# EAGLE design board (EAGLE 6.6.0)
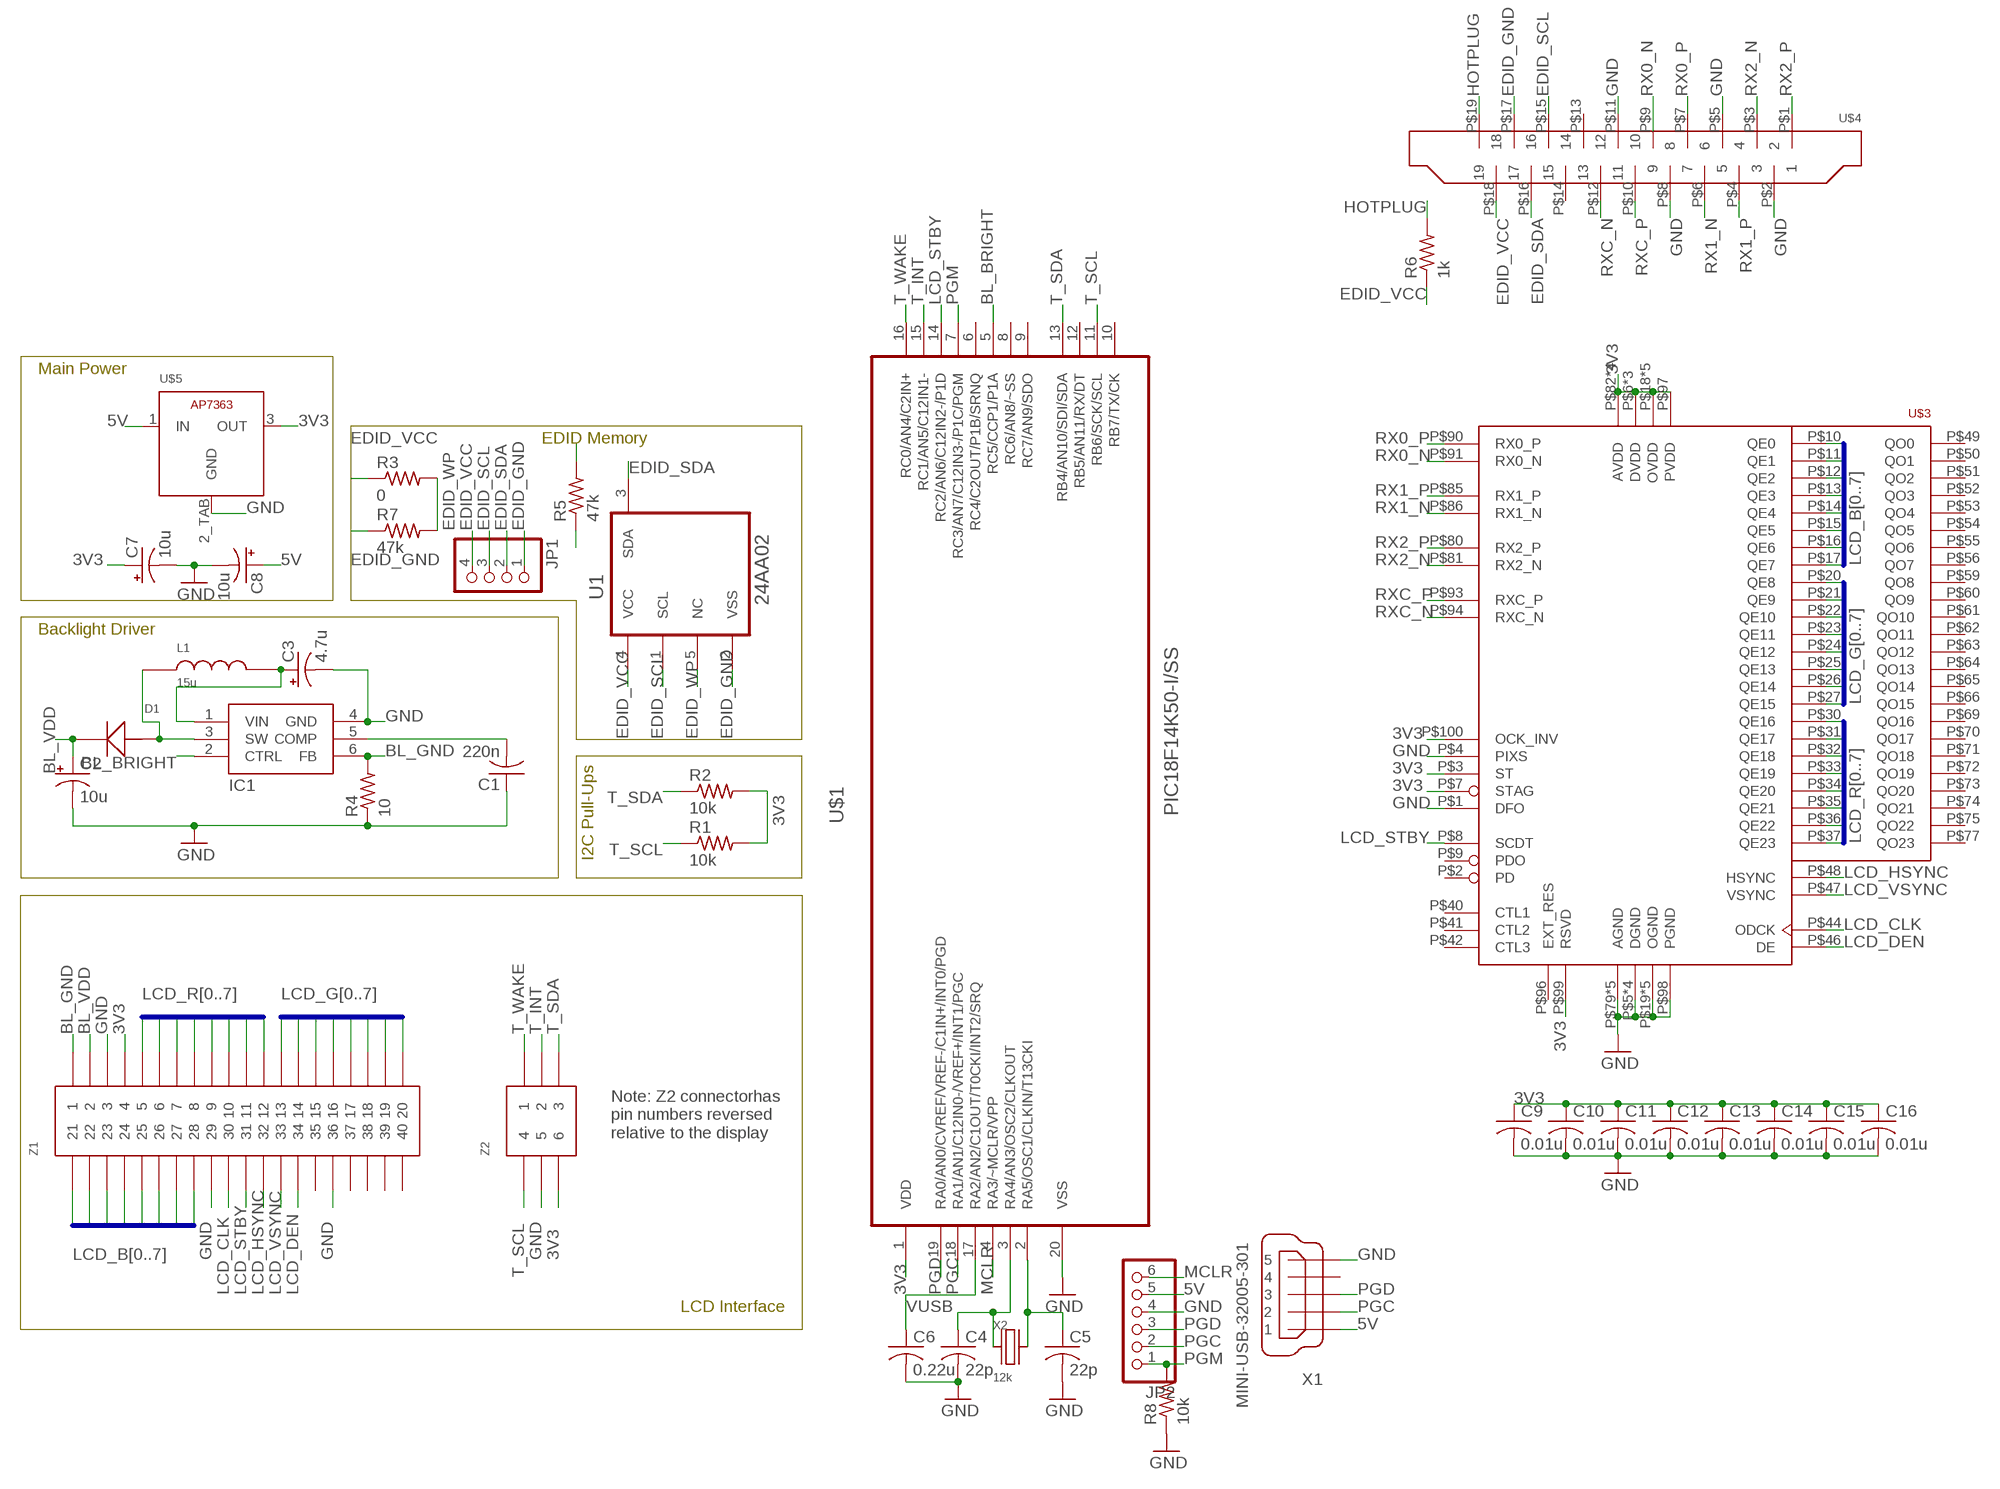
[diagram p0: schematic, sheet 1]

## Parts
C1  220n  C-USC1206  [C1206]
C2  10u  CPOL-USB  [PANASONIC_B]
C3  4.7u  CPOL-USB  [PANASONIC_B]
C4  22p  C-USC1206K  [C1206K]
C5  22p  C-USC1206K  [C1206K]
C6  0.22u  C-USC1206K  [C1206K]
C7  10u  CPOL-USB  [PANASONIC_B]
C8  10u  CPOL-USB  [PANASONIC_B]
C9  0.01u  C-USC0805  [C0805]
C10  0.01u  C-USC0805  [C0805]
C11  0.01u  C-USC0805  [C0805]
C12  0.01u  C-USC0805  [C0805]
C13  0.01u  C-USC0805  [C0805]
C14  0.01u  C-USC0805  [C0805]
C15  0.01u  C-USC0805  [C0805]
C16  0.01u  C-USC0805  [C0805]
D1  MBR0540  [SOD123]
IC1  TPS61165  [SOT-23-6]
JP1  PINHD-1X4/90  [1X04/90]
JP2  PINHD-1X6  [1X06]
L1  15u  0520CDMCDS  [0520CDMCDS]
R1  10k  R-US_R1206  [R1206]
R2  10k  R-US_R1206  [R1206]
R3  0  R-US_R0805  [R0805]
R4  10  R-US_R0805  [R0805]
R5  47k  R-US_R1206  [R1206]
R6  1k  R-US_R1206  [R1206]
R7  47k  R-US_R1206  [R1206]
R8  10k  R-US_R1206  [R1206]
U1  24AA02  24AA02E64T-I/OT  [SOT95P270X145-5N]
U$1  PIC18F14K50-I/SS  [SOP65P780X200-20N]
U$3  TFP401  [PQFP-100]
U$4  HDMI-RCPT  [HDMI-RA-SMD]
U$5  AP7363TO252  [TO252]
X1  MINI-USB-32005-301  [32005-301]
X2  12k  CTS-445  [CTS-445]
Z1  62684-401100ALF  [62684-401100ALF]
Z2  84952-6  [84952-6]

## Nets
3V3: C7.+ C9.1 C10.1 C11.1 C12.1 C13.1 C14.1 C15.1 C16.1 R1.2 R2.2 U$1.1(VDD) U$3.P$3(ST) U$3.P$6(DVDD) U$3.P$7(STAG) U$3.P$18(OVDD) U$3.P$29(OVDD) U$3.P$38(DVDD) U$3.P$43(OVDD) U$3.P$57(OVDD) U$3.P$67(DVDD) U$3.P$78(OVDD) U$3.P$82(AVDD) U$3.P$84(AVDD) U$3.P$88(AVDD) U$3.P$95(AVDD) U$3.P$97(PVDD) U$3.P$99(RSVD) U$3.P$100(OCK_INV) U$5.3(OUT) Z1.4 Z2.6
5V: C3.+ C8.+ IC1.1(VIN) JP2.5 L1.P$2 U$5.1(IN) X1.1
BL_BRIGHT: IC1.2(CTRL) U$1.5(RC5/CCP1/P1A)
BL_COMP: C1.2 IC1.5(COMP)
BL_GND: IC1.6(FB) R4.2 Z1.1
BL_SW: D1.A IC1.3(SW) L1.P$1
BL_VDD: C2.+ D1.K Z1.2
EDID_GND: JP1.1 R7.1 U1.2(VSS) U$4.P$17
EDID_SCL: JP1.3 R5.2 U1.1(SCL) U$4.P$15
EDID_SDA: JP1.2 U1.3(SDA) U$4.P$16
EDID_VCC: JP1.4 R3.1 R5.1 R6.1 U1.4(VCC) U$4.P$18
EDID_WP: R3.2 R7.2 U1.5(NC)
GND: C1.1 C2.- C3.- C4.2 C5.2 C6.2 C7.- C8.- C9.2 C10.2 C11.2 C12.2 C13.2 C14.2 C15.2 C16.2 IC1.4(GND) JP2.4 R4.1 R8.1 U$1.20(VSS) U$3.P$1(DFO) U$3.P$4(PIXS) U$3.P$5(DGND) U$3.P$19(OGND) U$3.P$28(OGND) U$3.P$39(DGND) U$3.P$45(OGND) U$3.P$58(OGND) U$3.P$68(DGND) U$3.P$76(OGND) U$3.P$79(AGND) U$3.P$83(AGND) U$3.P$87(AGND) U$3.P$89(AGND) U$3.P$92(AGND) U$3.P$98(PGND) U$3.PAD(DGND) U$4.P$2 U$4.P$5 U$4.P$8 U$4.P$11 U$5.2_TAB(GND) X1.5 Z1.3 Z1.29 Z1.36 Z2.5
HOTPLUG: R6.2 U$4.P$19
LCD_B0: U$3.P$10(QE0) Z1.21
LCD_B1: U$3.P$11(QE1) Z1.22
LCD_B2: U$3.P$12(QE2) Z1.23
LCD_B3: U$3.P$13(QE3) Z1.24
LCD_B4: U$3.P$14(QE4) Z1.25
LCD_B5: U$3.P$15(QE5) Z1.26
LCD_B6: U$3.P$16(QE6) Z1.27
LCD_B7: U$3.P$17(QE7) Z1.28
LCD_CLK: U$3.P$44(ODCK) Z1.30
LCD_DEN: U$3.P$46(DE) Z1.34
LCD_G0: U$3.P$20(QE8) Z1.13
LCD_G1: U$3.P$21(QE9) Z1.14
LCD_G2: U$3.P$22(QE10) Z1.15
LCD_G3: U$3.P$23(QE11) Z1.16
LCD_G4: U$3.P$24(QE12) Z1.17
LCD_G5: U$3.P$25(QE13) Z1.18
LCD_G6: U$3.P$26(QE14) Z1.19
LCD_G7: U$3.P$27(QE15) Z1.20
LCD_HSYNC: U$3.P$48(HSYNC) Z1.32
LCD_R0: U$3.P$30(QE16) Z1.5
LCD_R1: U$3.P$31(QE17) Z1.6
LCD_R2: U$3.P$32(QE18) Z1.7
LCD_R3: U$3.P$33(QE19) Z1.8
LCD_R4: U$3.P$34(QE20) Z1.9
LCD_R5: U$3.P$35(QE21) Z1.10
LCD_R6: U$3.P$36(QE22) Z1.11
LCD_R7: U$3.P$37(QE23) Z1.12
LCD_STBY: U$1.14(RC2/AN6/C12IN2-/P1D) U$3.P$8(SCDT) Z1.31
LCD_VSYNC: U$3.P$47(VSYNC) Z1.33
MCLR: JP2.6 U$1.4(RA3/~MCLR/VPP)
N$1: C4.1 U$1.3(RA4/AN3/OSC2/CLKOUT) X2.X1
N$2: C5.1 U$1.2(RA5/OSC1/CLKIN/T13CKI) X2.X2
PGC: JP2.2 U$1.18(RA1/AN1/C12IN0-/VREF+/INT1/PGC) X1.2
PGD: JP2.3 U$1.19(RA0/AN0/CVREF/VREF-/C1IN+/INT0/PGD) X1.3
PGM: JP2.1 R8.2 U$1.7(RC3/AN7/C12IN3-/P1C/PGM)
RX0_N: U$3.P$91(RX0_N) U$4.P$9
RX0_P: U$3.P$90(RX0_P) U$4.P$7
RX1_N: U$3.P$86(RX1_N) U$4.P$6
RX1_P: U$3.P$85(RX1_P) U$4.P$4
RX2_N: U$3.P$81(RX2_N) U$4.P$3
RX2_P: U$3.P$80(RX2_P) U$4.P$1
RXC_N: U$3.P$94(RXC_N) U$4.P$12
RXC_P: U$3.P$93(RXC_P) U$4.P$10
T_INT: U$1.15(RC1/AN5/C12IN1-) Z2.2
T_SCL: R1.1 U$1.11(RB6/SCK/SCL) Z2.4
T_SDA: R2.1 U$1.13(RB4/AN10/SDI/SDA) Z2.3
T_WAKE: U$1.16(RC0/AN4/C2IN+) Z2.1
VUSB: C6.1 U$1.17(RA2/AN2/C1OUT/T0CKI/INT2/SRQ)
Unconnected: U$1.6(RC4/C2OUT/P1B/SRNQ) U$1.8(RC6/AN8/~SS) U$1.9(RC7/AN9/SDO) U$1.10(RB7/TX/CK) U$1.12(RB5/AN11/RX/DT) U$3.P$2(PD) U$3.P$9(PDO) U$3.P$40(CTL1) U$3.P$41(CTL2) U$3.P$42(CTL3) U$3.P$49(QO0) U$3.P$50(QO1) U$3.P$51(QO2) U$3.P$52(QO3) U$3.P$53(QO4) U$3.P$54(QO5) U$3.P$55(QO6) U$3.P$56(QO7) U$3.P$59(QO8) U$3.P$60(QO9) U$3.P$61(QO10) U$3.P$62(QO11) U$3.P$63(QO12) U$3.P$64(QO13) U$3.P$65(QO14) U$3.P$66(QO15) U$3.P$69(QO16) U$3.P$70(QO17) U$3.P$71(QO18) U$3.P$72(QO19) U$3.P$73(QO20) U$3.P$74(QO21) U$3.P$75(QO22) U$3.P$77(QO23) U$3.P$96(EXT_RES) U$4.P$13 U$4.P$14 X1.4 Z1.35 Z1.37 Z1.38 Z1.39 Z1.40

## Buses
LCD_R[0..7]
LCD_G[0..7]
LCD_B[0..7]

## Notes on the sheet
- Main Power
- EDID Memory
- Backlight Driver
- I2C Pull-Ups
- Note: Z2 connectorhas
  pin numbers reversed
  relative to the display
- LCD Interface

## Library data of the parts
C1 C4-C6 C9-C16 = resistor:C-US: CAPACITOR, American symbol
C2 C3 C7 C8 = resistor:CPOL-US: POLARIZED CAPACITOR, American symbol
D1 = ic:MBR0540
IC1 = ic:TPS61165: TPS61165 High Brightness White LED Driver
JP1 = pinhead:PINHD-1X4: PIN HEADER
JP2 = pinhead:PINHD-1X6: PIN HEADER
L1 = ic:0520CDMCDS
R1-R8 = resistor:R-US_: RESISTOR, American symbol
U1 = Microchip-24AA02E64T-I_OT:24AA02E64T-I/OT: 2K I2C™ Serial EEPROMs, SOT23-5; MPN: 24AA02E64T-I/OT; OC_FARNELL: 2345567; OC_NEWARK: 01X0461; PACKAGE: SOT23-5; SUPPLIER: Microchip
U$1 = Microchip_By_element14_Batch_1:PIC18F14K50-I/SS: Flash Microcontrollers; MPN: PIC18F14K50-I/SS; OC_FARNELL: 1648504; OC_NEWARK: 77M3105; PACKAGE: SOP-20; SUPPLIER: Microchip
U$3 = tfp401:TFP401: TFP401 TI PANELBUS DIGITAL RECEIVER
U$4 = conn-hdmi:HDMI-RCPT
U$5 = ap7363:AP7363
X1 = con-cypressindustries:MINI-USB-: MINI USB-B Conector Source: www.cypressindustries.com; OC_FARNELL: unknown; OC_NEWARK: unknown
X2 = ic:CTS-445
Z1 = conn:62684-401100ALF
Z2 = conn:84952-6

## Board
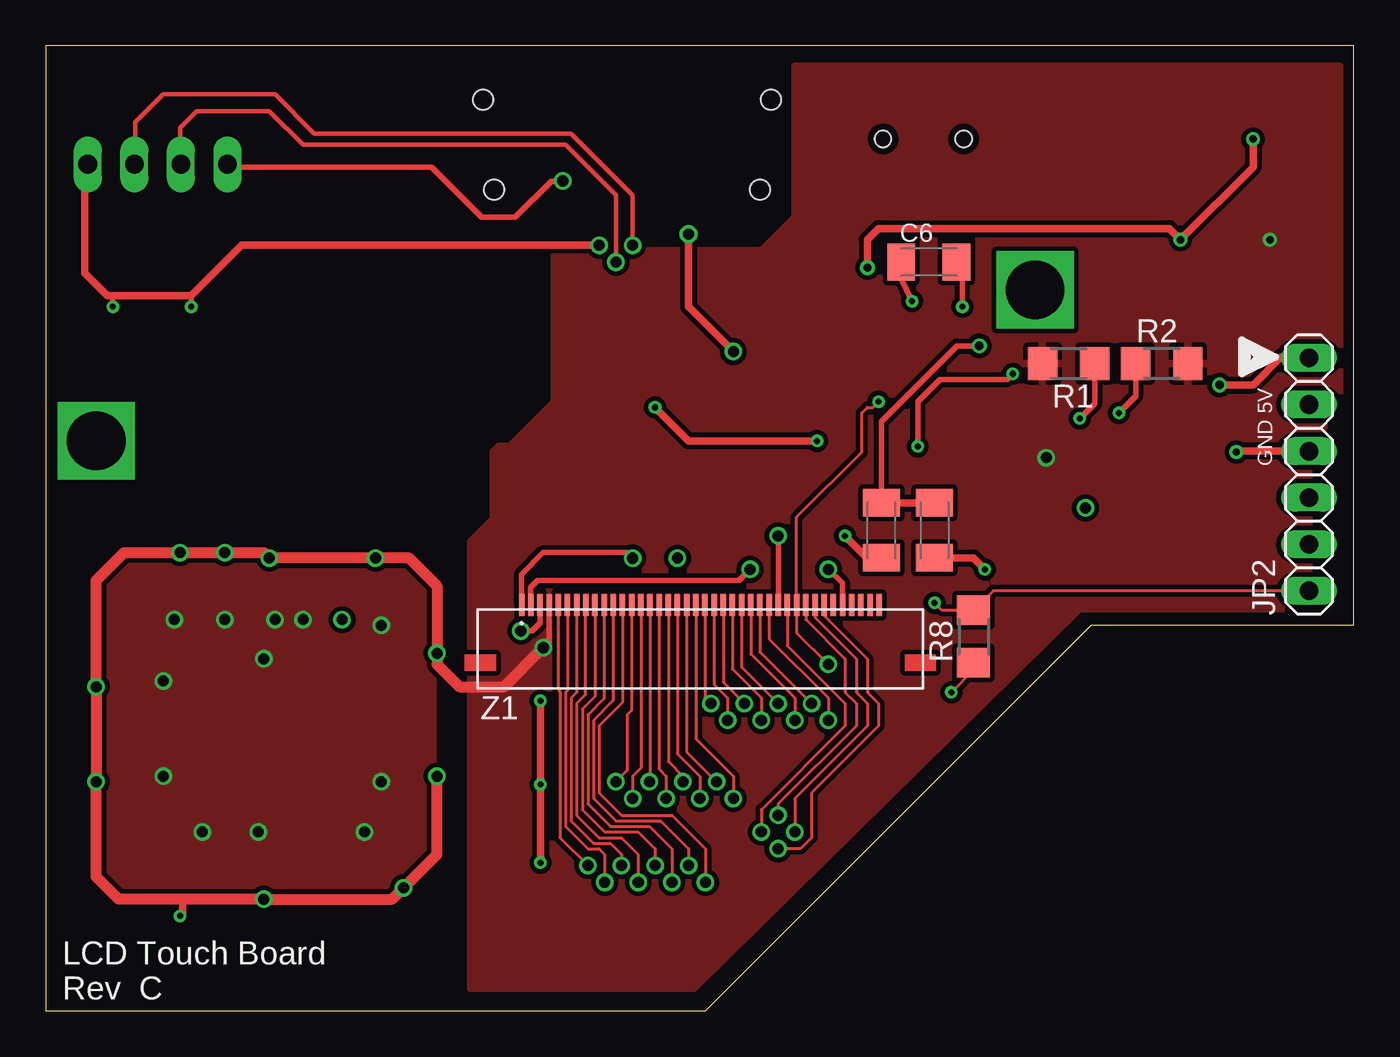
[diagram p1: board, top side]
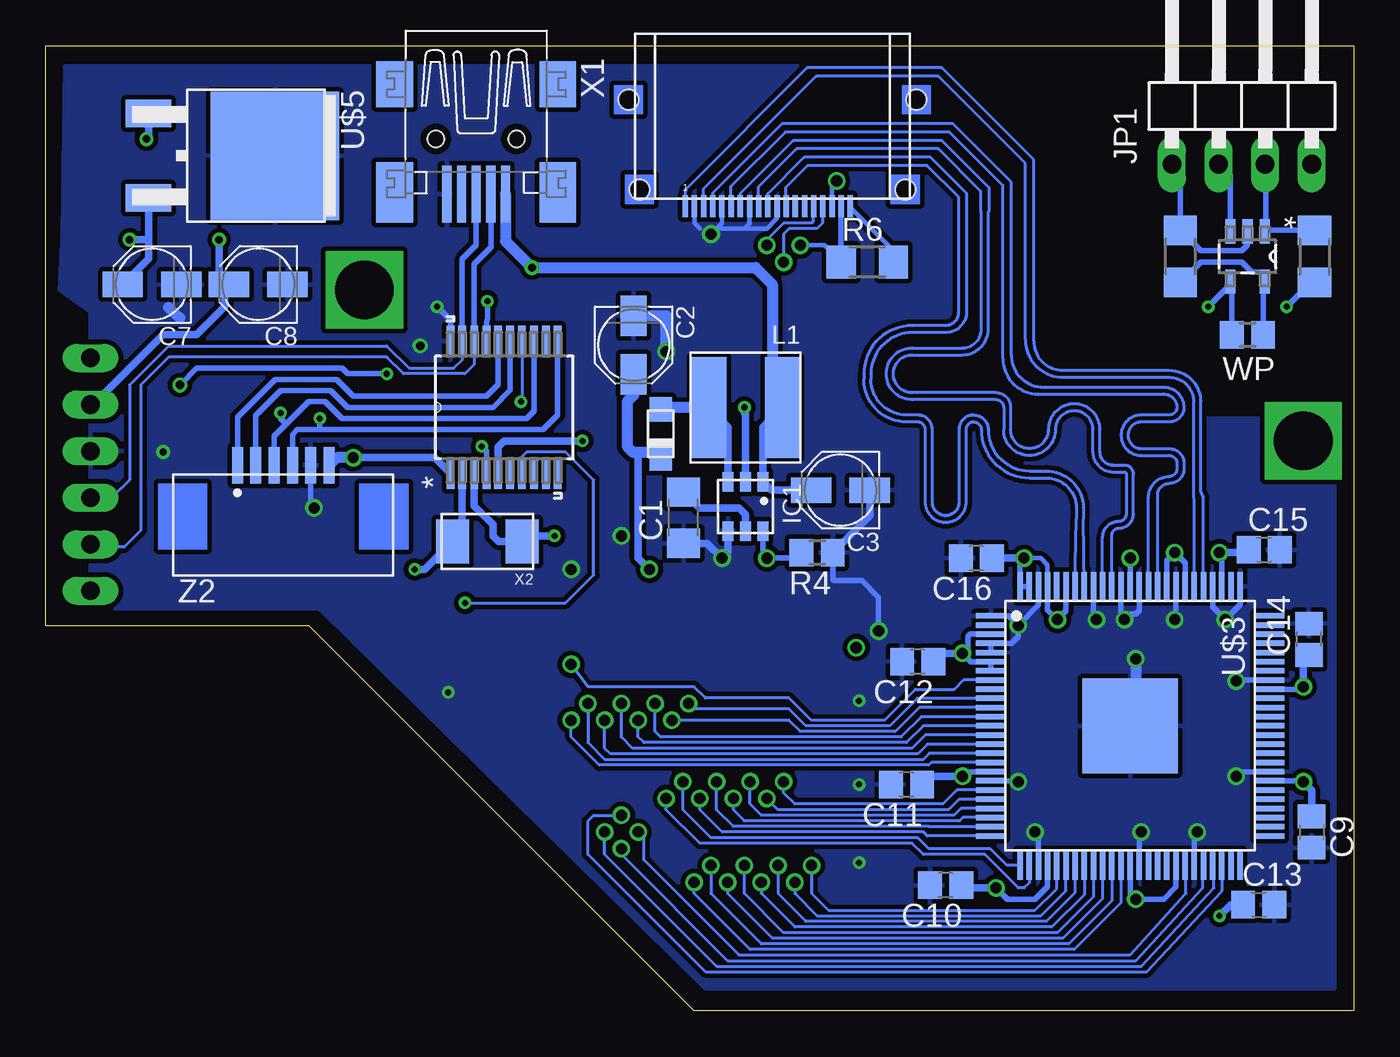
[diagram p2: board, bottom side, seen from below]

Size 71.32 x 52.64 mm. Coordinates in mm from the lower left corner, seen from the top.
Outline: 0,0 35.97,0 57,21.03 71.32,21.03 71.32,52.64 0,52.64 0,0
Copper layers (1*16): Top 0.0356mm / dielectric 1.5011mm / Bottom 0.0356mm
Design rules "LaenPCBOrder": minimum track width 6mil, minimum drill 13mil, track to track 6mil, track to pad 6mil, pad to pad 6mil, via to via 6mil, smd to smd 6mil, copper to edge 15mil, drill to drill 6mil, minimum pad ring 7mil, minimum via ring 7mil, stop-mask expansion 3mil, vias tented up to drill 0mil, thermal gap 10mil

### Footprints (pad centres in the part's own frame; a part is rotated, then mirrored left to right if it is on the bottom)
C1206 = smd 1.6 x 1.8: 1 -1.4,0; 2 1.4,0
PANASONIC_B = smd 2.2 x 1.4: + 1.6,0; - -1.6,0
C1206K = smd 1.5 x 2: 1 -1.5,0; 2 1.5,0
C0805 = smd 1.3 x 1.5: 1 -0.85,0; 2 0.85,0
SOD123 = smd 1.321 x 1.219: A -1.333,0; K 1.333,0
SOT-23-6 = smd 0.6 x 1.05: 1 -0.95,-1.35; 2 0,-1.35; 3 0.95,-1.35; 4 0.95,1.35; 5 0,1.35; 6 -0.95,1.35
1X04/90 = drill 1.016 long: 1 -3.81,-3.81; 2 -1.27,-3.81; 3 1.27,-3.81; 4 3.81,-3.81
1X06 = drill 1.016 long: 1 -6.35,0; 2 -3.81,0; 3 -1.27,0; 4 1.27,0; 5 3.81,0; 6 6.35,0
0520CDMCDS = smd 1.9 x 5.5: P$1 2,0; P$2 -2,0
R1206 = smd 1.6 x 1.803: 1 -1.422,0; 2 1.422,0
R0805 = smd 1.3 x 1.5: 1 -0.85,0; 2 0.85,0
SOT95P270X145-5N = smd 1.321 x 0.559: 1 -1.372,0.94; 2 -1.372,0; 3 -1.372,-0.94; 4 1.372,-0.94; 5 1.372,0.94
SOP65P780X200-20N = smd 1.676 x 0.432: 1 -3.607,2.921; 2 -3.607,2.286; 3 -3.607,1.626; 4 -3.607,0.965; 5 -3.607,0.33; 6 -3.607,-0.33; 7 -3.607,-0.965; 8 -3.607,-1.626; 9 -3.607,-2.286; 10 -3.607,-2.921; 11 3.607,-2.921; 12 3.607,-2.286; 13 3.607,-1.626; 14 3.607,-0.965; 15 3.607,-0.33; 16 3.607,0.33; 17 3.607,0.965; 18 3.607,1.626; 19 3.607,2.286; 20 3.607,2.921
PQFP-100 = smd 0.3 x 1.6: P$1 -6,-7.6; P$2 -5.5,-7.6; P$3 -5,-7.6; P$4 -4.5,-7.6; P$5 -4,-7.6; P$6 -3.5,-7.6; P$7 -3,-7.6; P$8 -2.5,-7.6; P$9 -2,-7.6; P$10 -1.5,-7.6; P$11 -1,-7.6; P$12 -0.5,-7.6; P$13 0,-7.6; P$14 0.5,-7.6; P$15 1,-7.6; P$16 1.5,-7.6; P$17 2,-7.6; P$18 2.5,-7.6; P$19 3,-7.6; P$20 3.5,-7.6; P$21 4,-7.6; P$22 4.5,-7.6; P$23 5,-7.6; P$24 5.5,-7.6; P$25 6,-7.6; P$51 6,7.6; P$52 5.5,7.6; P$53 5,7.6; P$54 4.5,7.6; P$55 4,7.6; P$56 3.5,7.6; P$57 3,7.6; P$58 2.5,7.6; P$59 2,7.6; P$60 1.5,7.6; P$61 1,7.6; P$62 0.5,7.6; P$63 0,7.6; P$64 -0.5,7.6; P$65 -1,7.6; P$66 -1.5,7.6; P$67 -2,7.6; P$68 -2.5,7.6; P$69 -3,7.6; P$70 -3.5,7.6; P$71 -4,7.6; P$72 -4.5,7.6; P$73 -5,7.6; P$74 -5.5,7.6; P$75 -6,7.6 | smd 1.6 x 0.3: P$26 7.6,-6; P$27 7.6,-5.5; P$28 7.6,-5; P$29 7.6,-4.5; P$30 7.6,-4; P$31 7.6,-3.5; P$32 7.6,-3; P$33 7.6,-2.5; P$34 7.6,-2; P$35 7.6,-1.5; P$36 7.6,-1; P$37 7.6,-0.5; P$38 7.6,0; P$39 7.6,0.5; P$40 7.6,1; P$41 7.6,1.5; P$42 7.6,2; P$43 7.6,2.5; P$44 7.6,3; P$45 7.6,3.5; P$46 7.6,4; P$47 7.6,4.5; P$48 7.6,5; P$49 7.6,5.5; P$50 7.6,6; P$76 -7.6,6; P$77 -7.6,5.5; P$78 -7.6,5; P$79 -7.6,4.5; P$80 -7.6,4; P$81 -7.6,3.5; P$82 -7.6,3; P$83 -7.6,2.5; P$84 -7.6,2; P$85 -7.6,1.5; P$86 -7.6,1; P$87 -7.6,0.5; P$88 -7.6,0; P$89 -7.6,-0.5; P$90 -7.6,-1; P$91 -7.6,-1.5; P$92 -7.6,-2; P$93 -7.6,-2.5; P$94 -7.6,-3; P$95 -7.6,-3.5; P$96 -7.6,-4; P$97 -7.6,-4.5; P$98 -7.6,-5; P$99 -7.6,-5.5; P$100 -7.6,-6 | smd 5.2 x 5.2: PAD 0,0
HDMI-RA-SMD = smd 0.3 x 1.2: P$1 4.75,0.6; P$2 4.25,0.6; P$3 3.75,0.6; P$4 3.25,0.6; P$5 2.75,0.6; P$6 2.25,0.6; P$7 1.75,0.6; P$8 1.25,0.6; P$9 0.75,0.6; P$10 0.25,0.6; P$11 -0.25,0.6; P$12 -0.75,0.6; P$13 -1.25,0.6; P$14 -1.75,0.6; P$15 -2.25,0.6; P$16 -2.75,0.6; P$17 -3.25,0.6; P$18 -3.75,0.6; P$19 -4.25,0.6 | hole 1.1: -7.25,-0.3; 7.25,-0.3; -7.85,-5.2; 7.85,-5.2
TO252 = smd 1.5 x 2.5: 1 -2.3,-6.9; 3 2.3,-6.9 | smd 7 x 7: 2_TAB 0,0
32005-301 = smd 3.1 x 0.5: 1 3,1.6; 2 3,0.8; 3 3,0; 4 3,-0.8; 5 3,-1.6 | smd 2.5 x 2: M1 -3,-4.45; M2 -3,4.45 | smd 3.3 x 2: M3 2.9,4.45; M4 2.9,-4.45 | hole 0.9: 0,2.2; 0,-2.2
CTS-445 = smd 1.8 x 2.4: X1 -1.9,0; X2 1.9,0
62684-401100ALF = smd 0.3 x 1.2: 1 -9.75,2; 2 -9.25,2; 3 -8.75,2; 4 -8.25,2; 5 -7.75,2; 6 -7.25,2; 7 -6.75,2; 8 -6.25,2; 9 -5.75,2; 10 -5.25,2; 11 -4.75,2; 12 -4.25,2; 13 -3.75,2; 14 -3.25,2; 15 -2.75,2; 16 -2.25,2; 17 -1.75,2; 18 -1.25,2; 19 -0.75,2; 20 -0.25,2; 21 0.25,2; 22 0.75,2; 23 1.25,2; 24 1.75,2; 25 2.25,2; 26 2.75,2; 27 3.25,2; 28 3.75,2; 29 4.25,2; 30 4.75,2; 31 5.25,2; 32 5.75,2; 33 6.25,2; 34 6.75,2; 35 7.25,2; 36 7.75,2; 37 8.25,2; 38 8.75,2; 39 9.25,2; 40 9.75,2
84952-6 = smd 0.6 x 2: 1 -2.5,1; 2 -1.5,1; 3 -0.5,1; 4 0.5,1; 5 1.5,1; 6 2.5,1

### Placement (x,y rotation side)
C1  36.55,26.9 90 bottom
C2  39.27,36.31 270 bottom
C3  27.99,28.4 180 bottom
C4  45.57,26.21 90 top
C5  48.46,26.21 90 top
C6  48.16,40.84 0 top
C7  65.53,39.62 180 bottom
C8  59.74,39.62 180 bottom
C9  2.29,9.75 270 bottom
C10  22.25,6.86 180 bottom
C11  24.38,12.34 180 bottom
C12  23.77,19.05 180 bottom
C13  5.18,5.79 0 bottom
C14  2.44,20.27 90 bottom
C15  4.88,25.15 0 bottom
C16  20.57,24.69 180 bottom
D1  37.78,31.47 270 bottom
IC1  33.16,27.51 180 bottom
JP1  6.1,49.99 0 bottom
JP2  68.88,29.26 90 top
L1  33.16,32.9 180 bottom
R1  55.78,35.31 180 top
R2  60.86,35.31 0 top
R3  5.79,36.88 0 bottom
R4  29.26,24.99 180 bottom
R5  2.13,41.15 90 bottom
R6  26.52,40.84 0 bottom
R7  9.45,41.15 270 bottom
R8  50.6,20.42 90 top
U1  5.79,41.15 270 bottom
U$1  46.33,32.92 90 bottom
U$3  12.19,15.54 270 bottom
U$4  31.7,44.5 180 bottom
U$5  58.83,46.63 270 bottom
X1  47.85,47.55 270 bottom
X2  47.24,25.6 180 bottom
Z1  35.7,20.14 0 top
Z2  58.38,28.76 0 bottom

### Tracks (layer width: path | path; a pad name or v marks a point on that pad's centre or on a via)
3V3  (via drill 0.33 pad 0.33, 0.41, 0.6, 0.61)
  Top 0.305: Z1.4 27.45,20.13 v27.13,19.81
  Top 0.406: v7.32,5.18 7.47,5.33 7.47,6.1
  Top 0.61: v27.13,19.81 24.99,17.68 22.56,17.68 21.34,18.9 v21.34,19.51 21.34,23.16 19.81,24.69 v17.98,24.69 v12.19,24.69 11.89,24.99 v9.75,24.99 v7.32,24.99 4.27,24.99 2.74,23.47 v2.74,17.68 v2.74,12.5 2.74,7.32 3.96,6.1 7.47,6.1 v11.89,6.1 18.9,6.1 v19.51,6.71 21.34,8.53 v21.34,12.8
  Bottom 0.254: U$3.P$97 16.69,24.31 17.07,24.69 v17.98,24.69
  Bottom 0.305: U$3.P$29 16.69,6.78 17.37,6.1 18.9,6.1 v19.51,6.71 | U$3.P$43 9.69,6.77 10.36,6.1 v11.89,6.1 12.19,6.4 U$3.P$38 | U$3.P$57 2.79,12.55 v2.74,12.5 | U$3.P$67 2.88,17.55 v2.74,17.68 | U$3.P$84 10.19,24.55 v9.75,24.99 9.19,24.43 U$3.P$82 | U$3.P$78 7.19,24.87 v7.32,24.99 | U$3.P$7 U$3.P$6 20.88,19.05 v21.34,19.51 21.03,19.51 21.03,20.42 20.91,20.55 U$3.P$3 | U$3.P$99 U$3.P$100 18.19,24.48 v17.98,24.69 | U$3.P$97 16.69,21.87 v16.15,21.34 15.69,21.8 U$3.P$95 | U$3.P$88 v12.19,24.69 | v21.34,12.8 21.09,13.05 U$3.P$18
  Bottom 0.406: v2.74,12.5 2.29,12.04 C9.1 | C10.1 21.25,6.71 v19.51,6.71 | C11.1 23.08,12.8 v21.34,12.8 | C12.1 22.47,19.51 v21.34,19.51 | v7.32,5.18 6.71,5.79 C13.1 | C14.1 2.74,19.11 v2.74,17.68 | C15.1 5.88,24.99 v7.32,24.99 | C16.1 v17.98,24.69 | v54.56,30.17 50.11,30.17 U$1.1 | U$5.3 65.73,42.06 | 65.73,42.06 65.73,41.03 C7.+ | v66.75,42.06 65.73,42.06
  Bottom 0.61: v54.56,30.17 55.46,30.17 Z2.6
  pour Top (isolate 0.254): 27.74,41.45 27.74,33.22 25.3,30.78 24.69,30.78 24.38,30.48 24.38,26.82 23.16,25.6 23.16,1.22 35.36,1.22 56.39,21.95 68.88,21.95 68.88,30.78 70.1,32.31 70.56,32.92 70.56,51.51 40.84,51.51 40.84,43.28 39.01,41.45
5V  (via drill 0.41, 0.46)
  Top 0.406: v44.81,40.54 44.81,42.06 45.42,42.67 61.27,42.67 v61.87,42.06 65.84,46.03 v65.84,47.55
  Bottom 0.406: C3.+ 31.75,28.4 IC1.1 32.21,31.85 L1.P$2 | 65.87,49.07 U$5.1 65.73,47.66 v65.84,47.55 | v61.87,42.06 61.87,40.16 C8.+ 61.57,39.4 61.57,38.41 63.09,36.88 64.92,36.88 68.73,33.07 JP2.5
  Bottom 0.61: 31.39,32.67 L1.P$2 | 31.15,32.92 L1.P$2 | X1.1 46.25,41.99 v44.81,40.54 32.61,40.54 31.7,39.62 31.7,33.44 L1.P$2
BL_BRIGHT  (via drill 0.33)
  Top 0.406: v42.06,31.09 35.05,31.09 v33.22,32.92
  Bottom 0.406: U$1.5 46.66,30.76 46.33,31.09 v42.06,31.09 | 33.22,32.61 v33.22,32.92 33.16,32.86 IC1.2
BL_COMP
  Bottom 0.406: C1.2 35.68,27.43 33.53,27.43 33.16,27.07 IC1.5
BL_GND  (via drill 0.61)
  Top 0.305: Z1.1 25.95,23.81 27.13,24.99 31.7,24.99 v32,24.69
  Bottom 0.305: 30.42,24.69 v32,24.69 32.21,24.9 IC1.6
  Bottom 0.406: 30.42,24.69 R4.2
BL_SW
  Bottom 0.406: IC1.3 34.11,31.85 L1.P$1
  Bottom 0.61: L1.P$1 37.54,32.9 D1.A
BL_VDD  (via drill 0.6)
  Top 0.305: Z1.2 26.45,23.09 26.82,23.47 37.8,23.47 v38.41,24.08
  Bottom 0.406: 39.32,30.48 39.01,30.17 39.01,24.69 v38.41,24.08
  Bottom 0.61: C2.+ 39.27,33.58 39.62,33.22 39.62,30.79 39.32,30.48 37.97,30.48 D1.K
EDID_GND  (via drill 0.61)
  Top 0.305: v28.19,45.26 27.58,45.26 25.6,43.28 23.77,43.28 21.03,46.03 10.06,46.03 JP1.1
  Bottom 0.254: U$4.P$17 28.45,45.01 v28.19,45.26
  Bottom 0.305: U1.2 5.79,41.76 6.1,41.45 8.33,41.45 R7.1 9.45,45.72 JP1.1
EDID_SCL  (via drill 0.61)
  Top 0.254: v32,41.76 32,44.5 28.65,47.85 14.63,47.85 12.5,49.99 6.4,49.99 4.88,48.46 4.88,46.23 JP1.3
  Bottom 0.152: v32,41.76 32,42.06 31.09,42.98 29.57,42.98 29.45,43.09 U$4.P$15
  Bottom 0.305: R5.2 4.8,42.57 | 4.8,42.57 U1.1 | 4.8,42.57 4.8,46.15 JP1.3
EDID_SDA  (via drill 0.61)
  Top 0.254: v31.09,40.84 31.09,44.5 28.35,47.24 14.02,47.24 12.19,49.07 8.23,49.07 7.32,48.16 7.32,46.23 JP1.2
  Bottom 0.152: v31.09,40.84 31.09,42.37 30.79,42.67 29.26,42.67 28.95,42.98 U$4.P$16
  Bottom 0.305: U1.3 6.73,45.54 JP1.2
EDID_VCC  (via drill 0.33, 0.61)
  Top 0.305: v3.66,38.41 3.66,39.01 | v7.93,38.41 7.93,39.01
  Top 0.406: JP1.4 2.13,46.03 2.13,40.23 3.35,39.01 3.66,39.01 7.93,39.01 10.67,41.76 v30.18,41.76
  Bottom 0.254: R6.1 28.85,41.76 v30.18,41.76
  Bottom 0.305: U$4.P$18 27.95,42.05 R6.1 | R3.1 6.64,39.69 U1.4 6.73,39.6 v7.93,38.41 | R5.1 2.34,39.73 v3.66,38.41
EDID_WP
  Bottom 0.305: R3.2 4.94,39.69 | 4.94,39.69 U1.5 | 4.94,39.69 4.94,40.3 5.55,40.3 6.1,40.84 8.33,40.84 R7.2
GND  (via drill 0.33, 0.33 pad 0.33, 0.41, 0.46, 0.6, 0.61)
  Top 0.152: R8.1 50.6,18.59 v49.38,17.37
  Top 0.305: Z1.29 39.95,25.89 v39.93,25.91 | Z1.36 43.45,23.33 v42.67,24.08 | Z1.3 26.95,21.15 26.52,20.73 v25.91,20.73 | v49.99,38.41 49.99,40.51 C6.2 | C4.2 45.57,32.16 49.68,36.27 v50.9,36.27
  Top 0.406: v35.05,42.37 35.05,38.41 v37.49,35.97 | v26.98,8.08 v26.98,12.34 v26.98,16.92 | C4.2 C5.2 | JP2.4 64.97,30.53 v64.92,30.48
  Bottom 0.254: U$4.P$2 35.95,42.96 35.66,42.67 | U$4.P$5 34.45,42.97 v35.05,42.37 34.75,42.67 33.22,42.67 | U$4.P$8 32.95,43.01 32.92,42.98 33.22,42.67 | U$4.P$11 31.45,43.23 32,42.67 33.22,42.67
  Bottom 0.305: Z2.5 56.88,27.55 v56.69,27.43 | U$3.P$19 18.34,12.55 v18.29,12.5 | U$3.P$28 17.19,9.57 v17.37,9.75 | U$3.P$45 8.69,9.6 v8.53,9.75 | U$3.P$39 11.69,9.64 v11.58,9.75 | U$3.P$58 6.16,13.05 v6.4,12.8 | U$3.P$68 6.34,18.05 v6.4,17.98 | U$3.P$79 7.69,22.02 v7.01,21.34 6.19,22.15 U$3.P$76 | U$3.P$83 9.69,21.4 v9.75,21.34 | U$3.P$1 18.8,21.55 v18.29,21.03 | U$3.P$5 U$3.P$4 18.67,20.05 18.29,20.42 v18.29,21.03 | U$3.P$98 17.19,22.13 v18.29,21.03 | U$3.P$92 14.19,21.51 v14.02,21.34 | U$3.P$89 12.69,21.53 v12.5,21.34 12.19,21.64 11.89,21.64 11.69,21.84 U$3.P$87 | R4.1 28.41,23.53 28.35,23.47 26.82,23.47 25.91,22.55 v25.91,20.73 | U$1.20 49.25,37.67 v49.99,38.41
  Bottom 0.406: IC1.4 34.11,25.02 v34.44,24.69 35.26,25.5 C1.1 | C3.- 26.39,27.02 R4.1
  Bottom 0.61: C2.- 37.49,37.9 v37.49,35.97 | 64.64,38.38 64.01,37.8 | v11.89,19.2 11.89,15.85 U$3.PAD
  pour Bottom (isolate 0.254): 21.34,51.51 21.34,32.31 1.07,32.31 1.07,1.22 35.36,1.22 56.39,21.95 68.88,21.95 68.88,38.1 70.56,39.32 70.41,42.37 70.26,51.51
  pour Top (isolate 0.254): 3.35,24.69 3.35,6.4 21.03,6.4 21.03,24.69
HOTPLUG
  Bottom 0.254: 27.45,43.81 25.1,41.45 R6.2
  Bottom 0.305: U$4.P$19 27.45,43.81
LCD_B0  (via drill 0.6)
  Top 0.152: Z1.21 35.95,17.09 v36.27,16.76
  Bottom 0.152: v36.27,16.76 35.97,16.46 30.79,16.46 29.87,15.55 25.3,15.55 23.8,17.05 U$3.P$10
LCD_B1  (via drill 0.6)
  Top 0.152: Z1.22 36.45,17.81 37.19,17.07 v37.19,15.85
  Bottom 0.152: v37.19,15.85 30.79,15.85 30.18,15.24 24.99,15.24 23.69,16.55 U$3.P$11
LCD_B2  (via drill 0.6)
  Top 0.152: Z1.23 36.95,17.92 v38.1,16.76
  Bottom 0.152: v38.1,16.76 38.1,15.24 37.8,14.94 24.69,14.94 23.58,16.05 U$3.P$12
LCD_B3  (via drill 0.6)
  Top 0.152: Z1.24 37.45,18.64 39.01,17.07 v39.01,15.85
  Bottom 0.152: v39.01,15.85 39.01,14.94 38.71,14.63 24.38,14.63 23.47,15.55 U$3.P$13
LCD_B4  (via drill 0.6)
  Top 0.152: Z1.25 37.95,18.75 v39.93,16.76
  Bottom 0.152: v39.93,16.76 39.93,14.94 39.32,14.33 24.08,14.33 23.36,15.05 U$3.P$14
LCD_B5  (via drill 0.6)
  Top 0.152: Z1.26 38.45,19.47 40.84,17.07 v40.84,15.85
  Bottom 0.152: v40.84,15.85 40.84,14.33 40.54,14.02 23.77,14.02 23.25,14.55 U$3.P$15
LCD_B6  (via drill 0.6)
  Top 0.152: Z1.27 38.95,19.58 v41.76,16.76
  Bottom 0.152: v41.76,16.76 41.76,14.63 40.84,13.72 23.47,13.72 23.14,14.05 U$3.P$16
LCD_B7  (via drill 0.6)
  Top 0.152: Z1.28 39.45,20.3 42.67,17.07 v42.67,15.85
  Bottom 0.152: v42.67,15.85 42.67,14.94 41.15,13.41 23.17,13.41 23.03,13.55 U$3.P$17
LCD_CLK  (via drill 0.6)
  Top 0.152: Z1.30 40.45,19.91 43.59,16.76 43.59,15.55 39.01,10.97 v39.01,9.75
  Bottom 0.152: U$3.P$44 9.14,7.9 9.14,6.4 12.19,3.05 33.53,3.05 38.71,8.23 38.71,9.45 v39.01,9.75
LCD_DEN  (via drill 0.6)
  Top 0.152: Z1.34 42.45,21.56 44.81,19.2 44.81,17.37 45.42,16.76 45.42,15.55 41.76,11.89 41.76,9.45 41.15,8.84 v39.93,8.84
  Bottom 0.152: v39.93,8.84 39.93,8.53 34.14,2.74 11.89,2.74 8.23,6.71 8.23,7.91 U$3.P$46
LCD_G0  (via drill 0.6)
  Top 0.152: Z1.13 31.95,16.4 31.7,16.15 31.7,13.11 v31.09,12.5
  Bottom 0.152: v31.09,12.5 31.09,11.89 30.48,11.28 22.4,11.28 21.64,12.05 U$3.P$20
LCD_G1  (via drill 0.6)
  Top 0.152: Z1.14 32.45,13.24 32,12.8 v32,11.58
  Bottom 0.152: v32,11.58 31.39,10.97 22.1,10.97 21.53,11.55 U$3.P$21
LCD_G2  (via drill 0.6)
  Top 0.152: Z1.15 32.95,12.52 v32.92,12.5
  Bottom 0.152: v32.92,12.5 32.92,11.28 32.31,10.67 21.79,10.67 21.42,11.05 U$3.P$22
LCD_G3  (via drill 0.6)
  Top 0.152: Z1.16 33.45,13.19 33.83,12.8 v33.83,11.58
  Bottom 0.152: v33.83,11.58 33.83,10.97 33.22,10.36 21.49,10.36 21.31,10.55 U$3.P$23
LCD_G4  (via drill 0.6)
  Top 0.152: Z1.17 33.95,13.6 34.75,12.8 v34.75,12.5
  Bottom 0.152: v34.75,12.5 34.75,10.97 33.83,10.06 23.17,10.06 23.15,10.05 U$3.P$24
LCD_G5  (via drill 0.6)
  Top 0.152: Z1.18 34.45,14.02 35.66,12.8 v35.66,11.58
  Bottom 0.152: v35.66,11.58 35.66,10.97 34.44,9.75 23.47,9.75 23.26,9.55 U$3.P$25
LCD_G6  (via drill 0.6)
  Top 0.152: Z1.19 34.95,14.13 v36.58,12.5
  Bottom 0.152: U$3.P$26 18.92,7.95 19.81,8.84 23.17,8.84 23.77,9.45 35.05,9.45 36.58,10.97 v36.58,12.5
LCD_G7  (via drill 0.6)
  Top 0.152: Z1.20 35.45,14.85 37.49,12.8 v37.49,11.58
  Bottom 0.152: v37.49,11.58 37.49,10.97 35.66,9.14 24.08,9.14 23.47,8.53 20.12,8.53 18.29,6.71 17.98,6.71 17.69,7 U$3.P$27
LCD_HSYNC  (via drill 0.6)
  Top 0.152: Z1.32 41.45,21.34 43.59,19.2 43.59,17.37 44.2,16.76 44.2,15.55 39.93,11.28 v39.93,10.67
  Bottom 0.152: v39.93,10.67 41.45,10.67 41.76,10.36 41.76,8.53 35.36,2.13 11.28,2.13 7.19,6.52 U$3.P$48
LCD_R0  (via drill 0.6)
  Top 0.152: Z1.5 27.95,17.58 28.04,17.37 28.04,9.45 v29.57,7.93
  Bottom 0.152: v29.57,7.93 29.57,6.4 28.65,5.49 17.37,5.49 16.19,6.67 U$3.P$30
LCD_R1  (via drill 0.6)
  Top 0.152: Z1.6 28.45,17.47 28.35,17.37 28.35,10.06 29.57,8.84 30.18,8.84 30.48,8.53 v30.48,7.01
  Bottom 0.152: v30.48,7.01 30.48,6.4 29.26,5.18 17.07,5.18 15.69,6.56 U$3.P$31
LCD_R2  (via drill 0.6)
  Top 0.152: Z1.7 28.95,17.36 28.65,17.07 28.65,10.36 29.87,9.14 30.79,9.14 31.39,8.53 v31.39,7.93
  Bottom 0.152: v31.39,7.93 31.39,6.4 29.87,4.88 16.76,4.88 15.19,6.45 U$3.P$32
LCD_R3  (via drill 0.6)
  Top 0.152: v32.31,7.01 32.31,8.53 31.39,9.45 30.18,9.45 28.96,10.67 28.96,16.76 29.45,17.25 Z1.8
  Bottom 0.152: v32.31,7.01 32.31,6.4 30.48,4.57 16.46,4.57 14.69,6.34 U$3.P$33
LCD_R4  (via drill 0.6)
  Top 0.152: Z1.9 29.95,17.14 29.26,16.46 29.26,10.97 30.48,9.75 32.31,9.75 33.22,8.84 v33.22,7.93
  Bottom 0.152: v33.22,7.93 33.22,6.4 31.09,4.27 16.15,4.27 14.19,6.23 U$3.P$34
LCD_R5  (via drill 0.6)
  Top 0.152: Z1.10 30.45,17.03 29.57,16.15 29.57,11.28 30.79,10.06 32.92,10.06 34.14,8.84 v34.14,7.01
  Bottom 0.152: v34.14,7.01 34.14,6.4 31.7,3.96 15.85,3.96 13.69,6.12 U$3.P$35
LCD_R6  (via drill 0.6)
  Top 0.152: Z1.11 30.95,16.92 29.87,15.85 29.87,11.58 31.09,10.36 33.53,10.36 35.05,8.84 v35.05,7.93
  Bottom 0.152: v35.05,7.93 35.05,6.4 32.31,3.66 15.55,3.66 13.19,6.01 U$3.P$36
LCD_R7  (via drill 0.6)
  Top 0.152: Z1.12 31.45,16.81 30.18,15.55 30.18,11.89 31.39,10.67 34.14,10.67 35.97,8.84 v35.97,7.01
  Bottom 0.152: v35.97,7.01 35.97,6.4 32.92,3.35 15.24,3.35 12.69,5.9 U$3.P$37
LCD_STBY  (via drill 0.33, 0.6)
  Top 0.152: v42.67,18.9 40.95,20.62 Z1.31 40.95,26.92 44.5,30.48 44.5,32.61 44.81,32.92 45.11,32.92 v45.42,33.22
  Bottom 0.152: v42.67,18.9 41.76,17.68 35.97,17.68 35.36,17.07 30.79,17.07 29.57,15.85 25.6,15.85 23.91,17.55 21.77,17.55 21.27,18.05 U$3.P$8 | U$1.14 45.36,33.27 v45.42,33.22
LCD_VSYNC  (via drill 0.6)
  Top 0.152: Z1.33 41.95,21.45 44.2,19.2 44.2,17.37 44.81,16.76 44.81,15.55 40.84,11.58 v40.84,9.75
  Bottom 0.152: v40.84,9.75 40.84,8.53 34.75,2.44 11.58,2.44 7.62,6.71 7.62,7.87 U$3.P$47
MCLR  (via drill 0.33, 0.46)
  Top 0.305: v47.55,30.79 47.55,33.22 48.77,34.44 52.43,34.44 v52.73,34.75
  Top 0.406: v64.01,34.14 65.84,34.14 67.36,35.66 68.83,35.66 JP2.6
  Bottom 0.305: U$1.4 47.3,30.53 v47.55,30.79 | v52.73,34.75 54.86,34.75 55.17,35.05 63.09,35.05 v64.01,34.14
N$1  (via drill 0.33)
  Top 0.406: C4.1 44.78,24.71 v43.59,25.91
  Bottom 0.406: U$1.3 47.96,27.53 46.94,26.52 46.94,25.91 46.63,25.6 X2.X1 45.04,25.91 v43.59,25.91
N$2  (via drill 0.33)
  Top 0.406: C5.1 50.57,24.71 v51.21,24.08
  Bottom 0.406: U$1.2 48.62,26.13 X2.X2 50.67,24.08 v51.21,24.08
N$3  (via drill 3.2)
  other vias: 2.74,31.09
N$4  (via drill 3.2)
  other vias: 53.95,39.32
PGC
  Bottom 0.152: U$1.18 47.96,35.26 48.46,34.75 51.82,34.75 52.73,35.66 64.62,35.66 66.14,34.14 66.14,26.21 67.06,25.3 68.73,25.3 JP2.2
  Bottom 0.305: U$1.18 47.96,40.74 47.05,41.64 X1.2
PGD
  Bottom 0.152: U$1.19 48.62,35.51 49.07,35.05 51.51,35.05 52.73,36.27 64.62,36.27 66.75,34.14 66.75,28.96 67.67,28.04 68.83,28.04 JP2.3
  Bottom 0.305: U$1.19 48.62,41 47.85,41.76 X1.3
PGM  (via drill 0.33)
  Top 0.152: JP2.1 51.66,22.91 R8.2 48.87,21.84 v48.46,22.25
  Bottom 0.152: v48.46,22.25 42.98,22.25 41.45,23.77 41.45,28.96 42.98,30.48 45.11,30.48 45.42,30.17 45.42,29.36 U$1.7
RX0_N
  Bottom 0.152: U$4.P$9 32.45,44.95 30.39,47.02 22.65,47.02 20.35,44.71 20.35,43.62 arc-90 20.31,43.59 20.31,37.19 arc90 21.34,36.16 24.08,36.16 arc-90 25.49,34.75 arc-90 24.08,33.34 19.51,33.34 arc90 19.09,32.92 19.09,31.7 arc-90 17.68,30.29 arc-90 16.27,31.7 arc90 15.24,32.73 arc90 14.21,31.7 14.21,30.48 arc-90 13.11,29.38 12.5,29.38 arc90 12.38,29.26 12.38,27.13 arc90 12.8,26.71 arc-90 13.69,25.82 U$3.P$91
RX0_P
  Bottom 0.152: U$4.P$7 33.45,44.6 30.57,47.47 22.46,47.47 19.89,44.9 19.89,43.62 arc90 19.93,43.59 19.93,37.19 arc90 21.34,35.78 24.08,35.78 arc-90 25.11,34.75 arc-90 24.08,33.72 19.51,33.72 arc90 18.71,32.92 18.71,31.7 arc-90 17.68,30.67 arc-90 16.65,31.7 arc90 15.24,33.11 arc90 13.83,31.7 13.83,30.48 arc-90 13.11,29.76 12.5,29.76 arc90 12,29.26 12,27.13 arc90 12.8,26.33 arc-90 13.19,25.94 U$3.P$90
RX1_N
  Bottom 0.152: U$4.P$6 33.95,44.98 31,47.93 22.04,47.93 19.13,45.02 19.13,35.57 arc-90 17.2,33.64 10.36,33.64 arc90 9.64,32.92 arc90 10.06,32.5 11.58,32.5 arc-90 12.69,31.39 arc-90 11.58,30.29 10.06,30.29 arc90 9.64,29.87 9.64,29.57 arc90 10.06,29.15 arc-90 11.19,28.01 U$3.P$86
RX1_P
  Bottom 0.152: U$4.P$4 34.95,44.62 31.18,48.39 21.85,48.39 18.67,45.2 18.67,35.76 arc-90 16.94,34.02 10.36,34.02 arc90 9.26,32.92 arc90 10.06,32.12 11.58,32.12 arc-90 12.31,31.39 arc-90 11.58,30.67 10.06,30.67 arc90 9.26,29.87 9.26,29.57 arc90 10.06,28.77 arc-90 10.69,28.13 U$3.P$85
RX2_N
  Bottom 0.152: U$3.P$81 8.69,27.88 8.73,28.03 8.73,33.22 arc-90 10.06,34.56 15.85,34.56 arc90 17.91,36.61 17.91,46.23 22.65,50.98 29.32,50.98 35.45,44.85 U$4.P$3
RX2_P
  Bottom 0.152: U$3.P$80 8.19,28.02 8.34,28.37 8.34,33.22 arc-90 10.06,34.94 15.85,34.94 arc90 17.45,36.54 17.45,46.42 22.46,51.44 29.81,51.44 36.45,44.8 U$4.P$1
RXC_N
  Bottom 0.152: U$4.P$12 30.95,44.93 29.78,46.1 23.26,46.1 21.56,44.41 21.56,38.06 arc90 22.25,37.38 24.08,37.38 arc-90 26.71,34.75 26.71,34.44 arc-90 24.38,32.12 23.77,32.12 arc90 23.36,31.7 23.36,27.74 arc-90 22.25,26.63 arc-90 21.15,27.74 21.15,31.7 arc90 20.73,32.12 arc90 20.31,31.7 arc-90 17.68,29.07 16.76,29.07 arc90 15.13,27.43 15.13,26.82 U$3.P$94
RXC_P
  Bottom 0.152: U$4.P$10 31.95,44.57 29.97,46.56 23.07,46.56 21.11,44.59 21.11,38.14 arc90 22.25,36.99 24.08,36.99 arc-90 26.33,34.75 26.33,34.44 arc-90 24.38,32.5 23.77,32.5 arc90 22.97,31.7 22.97,27.74 arc-90 22.25,27.01 arc-90 21.53,27.74 21.53,31.7 arc90 20.73,32.5 arc90 19.93,31.7 arc-90 17.68,29.45 16.76,29.45 arc90 14.75,27.43 14.75,26.82 U$3.P$93
T_INT
  Bottom 0.305: Z2.2 59.88,32.48 58.52,33.83 55.78,33.83 54.86,32.92 46.94,32.92 46,33.86 U$1.15
T_SCL  (via drill 0.33)
  Top 0.305: R1.1 57.2,33.12 v56.39,32.31
  Bottom 0.305: Z2.4 57.88,31.43 57.61,31.7 56.39,31.7 | 56.39,31.7 44.2,31.7 43.41,32.49 U$1.11 | v56.39,32.31 56.39,31.7
T_SDA  (via drill 0.33)
  Top 0.305: R2.1 59.44,33.53 v58.52,32.61
  Bottom 0.305: Z2.3 58.88,31.35 58.22,32 | 58.22,32 57,33.22 56.08,33.22 55.17,32.31 45.11,32.31 44.7,32.72 U$1.13 | v58.52,32.61 58.52,32.31 58.22,32
T_WAKE
  Bottom 0.305: Z2.1 60.88,32.39 58.83,34.44 55.47,34.44 54.56,33.53 47.3,33.53 46.66,34.16 U$1.16
VUSB  (via drill 0.33)
  Top 0.305: C6.1 46.66,39.91 v47.24,38.71
  Bottom 0.305: v47.24,38.71 47.24,37.8 47.3,37.54 U$1.17

### Text on the board
tPlace: GND 5V | LCD Touch Board / Rev C
bPlace: WP